# EAGLE design Optical Encoder 10-12-16 (EAGLE 7.2.0)
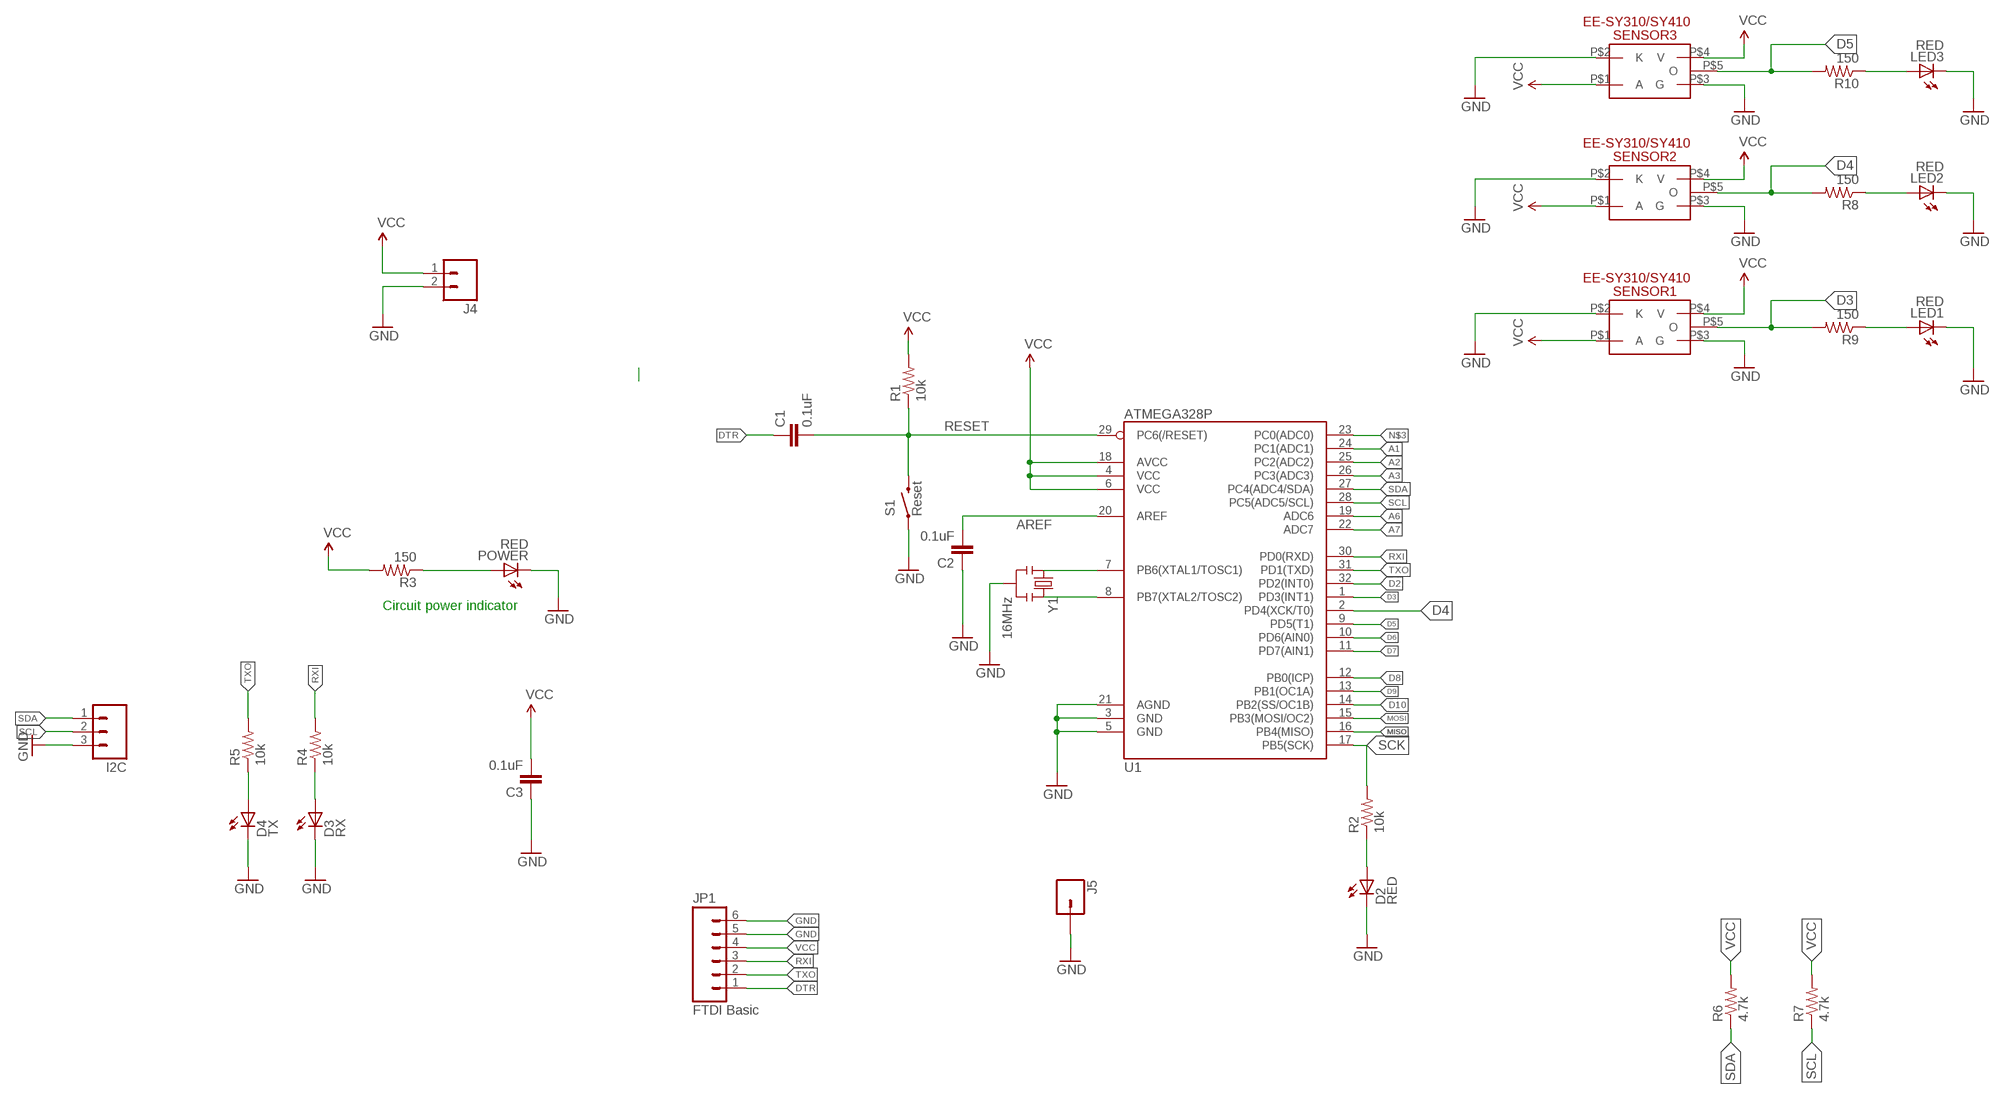
[diagram p0: schematic, sheet 1]

## Parts
C1  0.1uF  CAP0603-CAP  [0603-CAP]
C2  0.1uF  CAP0603-CAP  [0603-CAP]
C3  0.1uF  CAP0603-CAP  [0603-CAP]
D2  RED  LED-RED0603  [LED-0603]
D3  RX  LED-GREEN0603  [LED-0603]
D4  TX  LED-RED0603  [LED-0603]
I2C  M03PTH  [1X03]
J4  M02PTH  [1X02]
J5  M01PTH  [1X01]
JP1  FTDI Basic  M06POLAR  [MOLEX-1X6]
LED1  RED  LED-RED0603  [LED-0603]
LED2  RED  LED-RED0603  [LED-0603]
LED3  RED  LED-RED0603  [LED-0603]
POWER  RED  LED-RED0603  [LED-0603]
R1  10k  RESISTOR0603-RES  [0603-RES]
R2  10k  RESISTOR0603-RES  [0603-RES]
R3  150  RESISTOR1206  [1206]
R4  10k  RESISTOR0603-RES  [0603-RES]
R5  10k  RESISTOR0603-RES  [0603-RES]
R6  4.7k  RESISTOR1206  [1206]
R7  4.7k  RESISTOR1206  [1206]
R8  150  RESISTOR1206  [1206]
R9  150  RESISTOR1206  [1206]
R10  150  RESISTOR1206  [1206]
S1  Reset  SWITCH-MOMENTARY-2SMD  [TACTILE_SWITCH_SMD]
SENSOR1  EE-SY310/SY410  [EE-SY310/SY410]
SENSOR2  EE-SY310/SY410  [EE-SY310/SY410]
SENSOR3  EE-SY310/SY410  [EE-SY310/SY410]
U1  ATMEGA328P  ATMEGA328_SMT  [TQFP32-08]
Y1  16MHz  RESONATOR16MHZ  [RESONATOR-SMD]

## Nets
A1: U1.24(PC1(ADC1))
A2: U1.25(PC2(ADC2))
A3: U1.26(PC3(ADC3))
A6: U1.19(ADC6)
A7: U1.22(ADC7)
AREF: C2.2 U1.20(AREF)
D2: U1.32(PD2(INT0))
D3: R9.2 SENSOR1.P$5(O) U1.1(PD3(INT1))
D4: R8.2 SENSOR2.P$5(O) U1.2(PD4(XCK/T0))
D5: R10.2 SENSOR3.P$5(O) U1.9(PD5(T1))
D6: U1.10(PD6(AIN0))
D7: U1.11(PD7(AIN1))
D8: U1.12(PB0(ICP))
D9: U1.13(PB1(OC1A))
D10: U1.14(PB2(SS/OC1B))
DTR: C1.1 JP1.1
GND: C2.1 C3.1 D2.C D3.C D4.C I2C.3 J4.2 J5.1 JP1.5 JP1.6 LED1.C LED2.C LED3.C POWER.C S1.1 SENSOR1.P$2(K) SENSOR1.P$3(G) SENSOR2.P$2(K) SENSOR2.P$3(G) SENSOR3.P$2(K) SENSOR3.P$3(G) U1.3(GND) U1.5(GND) U1.21(AGND) Y1.2
MISO: U1.16(PB4(MISO))
MOSI: U1.15(PB3(MOSI/OC2))
N$1: U1.7(PB6(XTAL1/TOSC1)) Y1.1
N$2: U1.8(PB7(XTAL2/TOSC2)) Y1.3
N$3: U1.23(PC0(ADC0))
N$4: D2.A R2.1
N$5: D3.A R4.1
N$6: D4.A R5.1
N$7: LED1.A R9.1
N$9: POWER.A R3.1
N$19: LED3.A R10.1
N$20: LED2.A R8.1
RESET: C1.2 R1.1 S1.3 U1.29(PC6(/RESET))
RXI: JP1.3 R4.2 U1.30(PD0(RXD))
SCK: R2.2 U1.17(PB5(SCK))
SCL: I2C.2 R7.1 U1.28(PC5(ADC5/SCL))
SDA: I2C.1 R6.1 U1.27(PC4(ADC4/SDA))
TXO: JP1.2 R5.2 U1.31(PD1(TXD))
VCC: C3.2 J4.1 JP1.4 R1.2 R3.2 R6.2 R7.2 SENSOR1.P$1(A) SENSOR1.P$4(V) SENSOR2.P$1(A) SENSOR2.P$4(V) SENSOR3.P$1(A) SENSOR3.P$4(V) U1.4(VCC) U1.6(VCC) U1.18(AVCC)

## Notes on the sheet
- Circuit power indicator

## Library data of the parts
C1-C3 = SparkFun-Passives:CAP: Capacitor Standard 0603 ceramic capacitor, and 0.1" leaded capacitor.
D2 LED1-LED3 POWER = SparkFun-LED:LED-RED: Assorted Red LEDs LilyPad 1206- DIO-09912 1206- DIO-00809 0603- DIO-00819; PROD_ID: DIO-00819
D3 = SparkFun-LED:LED-GREEN: Various green LEDs Green LEDs used in SFE Production 0603- DIO-00821 LARGE- DIO-00862 LILYPAD- DIO-09910; PROD_ID: DIO-00821; VALUE: GREEN
D4 = SparkFun-LED:LED-RED: Assorted Red LEDs LilyPad 1206- DIO-09912 1206- DIO-00809 0603- DIO-00819; PROD_ID: DIO-00819; VALUE: RED
I2C = SparkFun-Connectors:M03: Header 3 Standard 3-pin 0.1" header. Use with straight break away headers (SKU : PRT-00116), right angle break away headers (PRT-00553), swiss pins (PRT-00743), machine pins (PRT-00117), and female headers (PRT-00115). Molex polarized connector foot print use with SKU : PRT-08232 with associated crimp pins and housings.
J4 = SparkFun-Connectors:M02: Standard 2-pin 0.1" header. Use with - straight break away headers ( PRT-00116) - right angle break away headers (PRT-00553) - swiss pins (PRT-00743) - machine pins (PRT-00117) - female headers (PRT-00115) Molex polarized connector foot print use with: PRT-08233 with associated crimp pins and housings. 2.54_SCREWTERM for use with PRT-10571. 3.5mm Screw Terminal footprints for PRT-08084 5mm Screw Terminal footprints for use with PRT-08432
J5 = SparkFun-Connectors:M01: Header 1 Standard 1-pin 0.1" header. Use with straight break away headers (SKU : PRT-00116), right angle break away headers (PRT-00553), swiss pins (PRT-00743), machine pins (PRT-00117), and female headers (PRT-00115). SMTSO-256-ET is a "flush mount" nut for a 4-40 screw. The older package used to be too tight, and did not allow it to sit properly thru the drill hit. The latest (0.165DIA) fits nice and snug.
JP1 = SparkFun-Connectors:M06: Header 6 Standard 6-pin 0.1" header. Use with straight break away headers (SKU : PRT-00116), right angle break away headers (PRT-00553), swiss pins (PRT-00743), machine pins (PRT-00117), and female headers (PRT-00115). Molex polarized connector foot print use with SKU : PRT-08094 with associated crimp pins and housings. NOTES ON THE VARIANTS LOCK and LOCK_LONGPADS... This footprint was designed to help hold the alignment of a through-hole component (i.e. 6-pin header) while soldering it into place. You may notice that each hole has been shifted either up or down by 0.005 of an inch from it's more standard position (which is a perfectly straight line). This slight alteration caused the pins (the squares in the middle) to touch the edges of the holes. Because they are alternating, it causes a "brace" to hold the component in place. 0.005 has proven to be the perfect amount of "off-center" position when using our standard breakaway headers. Although looks a little odd when you look at the bare footprint, once you have a header in there, the alteration is very hard to notice. Also,if you push a header all the way into place, it is covered up entirely on the bottom side. This idea of altering the position of holes to aid alignment will be further integrated into the Sparkfun Library for other footprints. It can help hold any component with 3 or more connection pins.
R1 R2 R4 R5 = SparkFun-Passives:RESISTOR: Resistor Basic schematic elements and footprints for 0603, 1206, and PTH resistors.
R3 R6-R10 = SparkFun-Resistors:RESISTOR: Resistor Basic schematic elements and footprints for 0603, 1206, and PTH resistors.
S1 = SparkFun-Electromechanical:SWITCH-MOMENTARY-2: Various NO switches- pushbuttons, reed, etc; PROD_ID: SWCH-08247
SENSOR1-SENSOR3 = EE-SY310-SY410:EE-SY310/SY410
U1 = SparkFun-DigitalIC:ATMEGA328_SMT: 32-Pin Atmega328 part Commonly used on Arduino compatible boards Available in QFP and QFN packages TQFP is IC-09069 QFN is non-stock; PROD_ID: IC-09069
Y1 = SparkFun-FreqCtrl:RESONATOR: Resonator Small SMD resonator. Used, eg, on the Arduino Pro/ Pro Mini boards. 8MHz- XTAL-08895 16MHz- XTAL-08900; PROD_ID: XTAL-08900

## Board
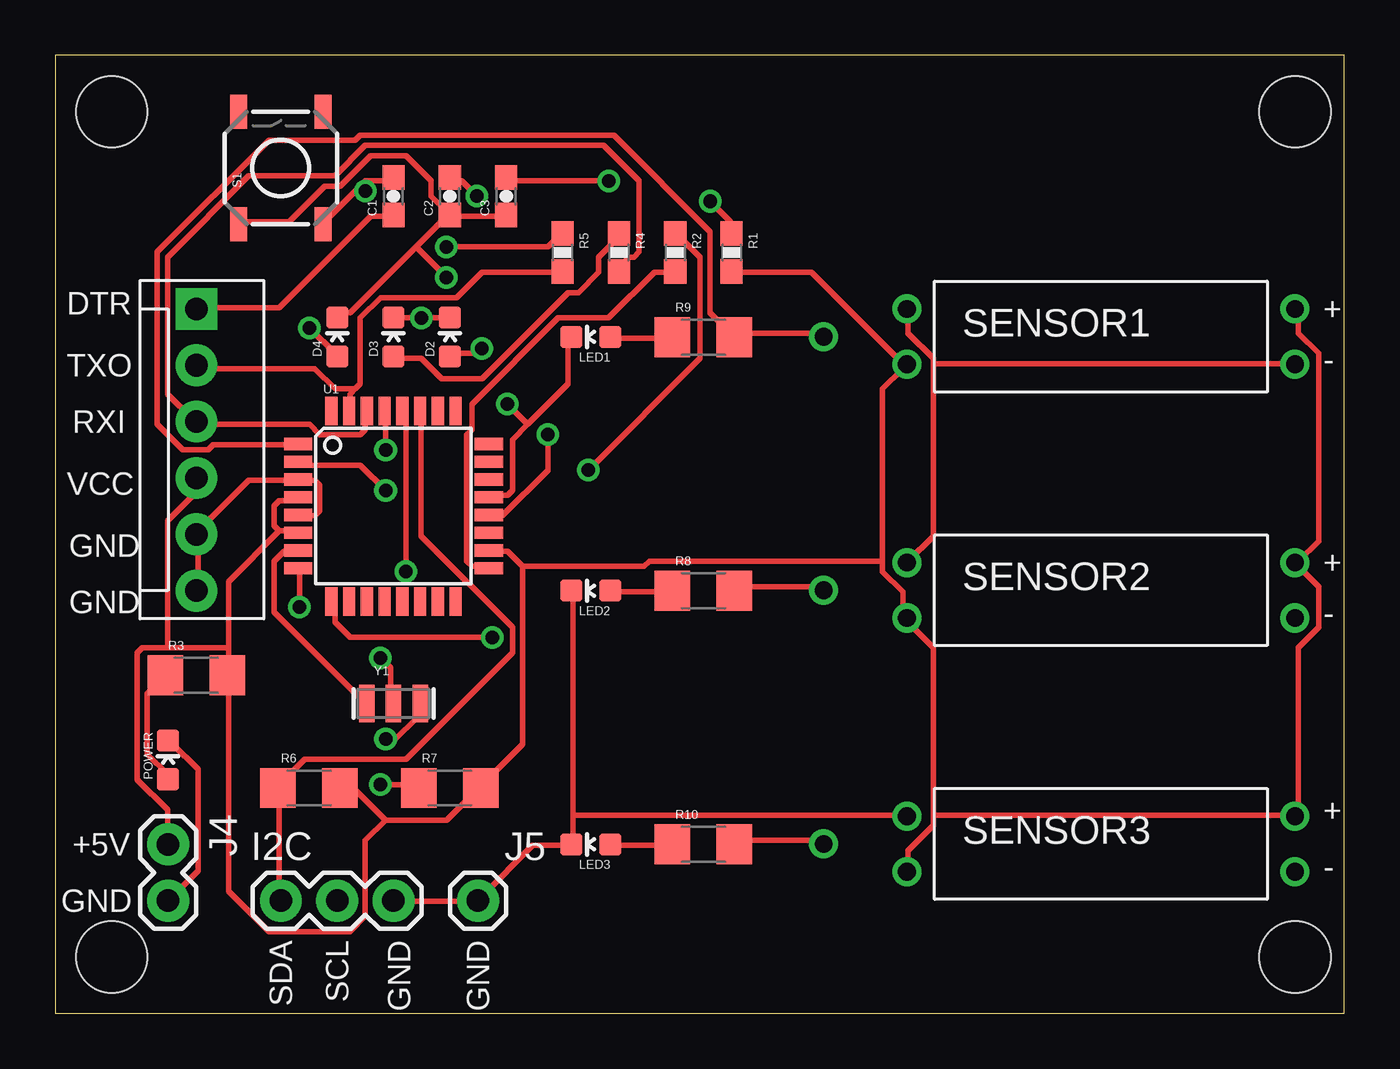
[diagram p1: board, top side]
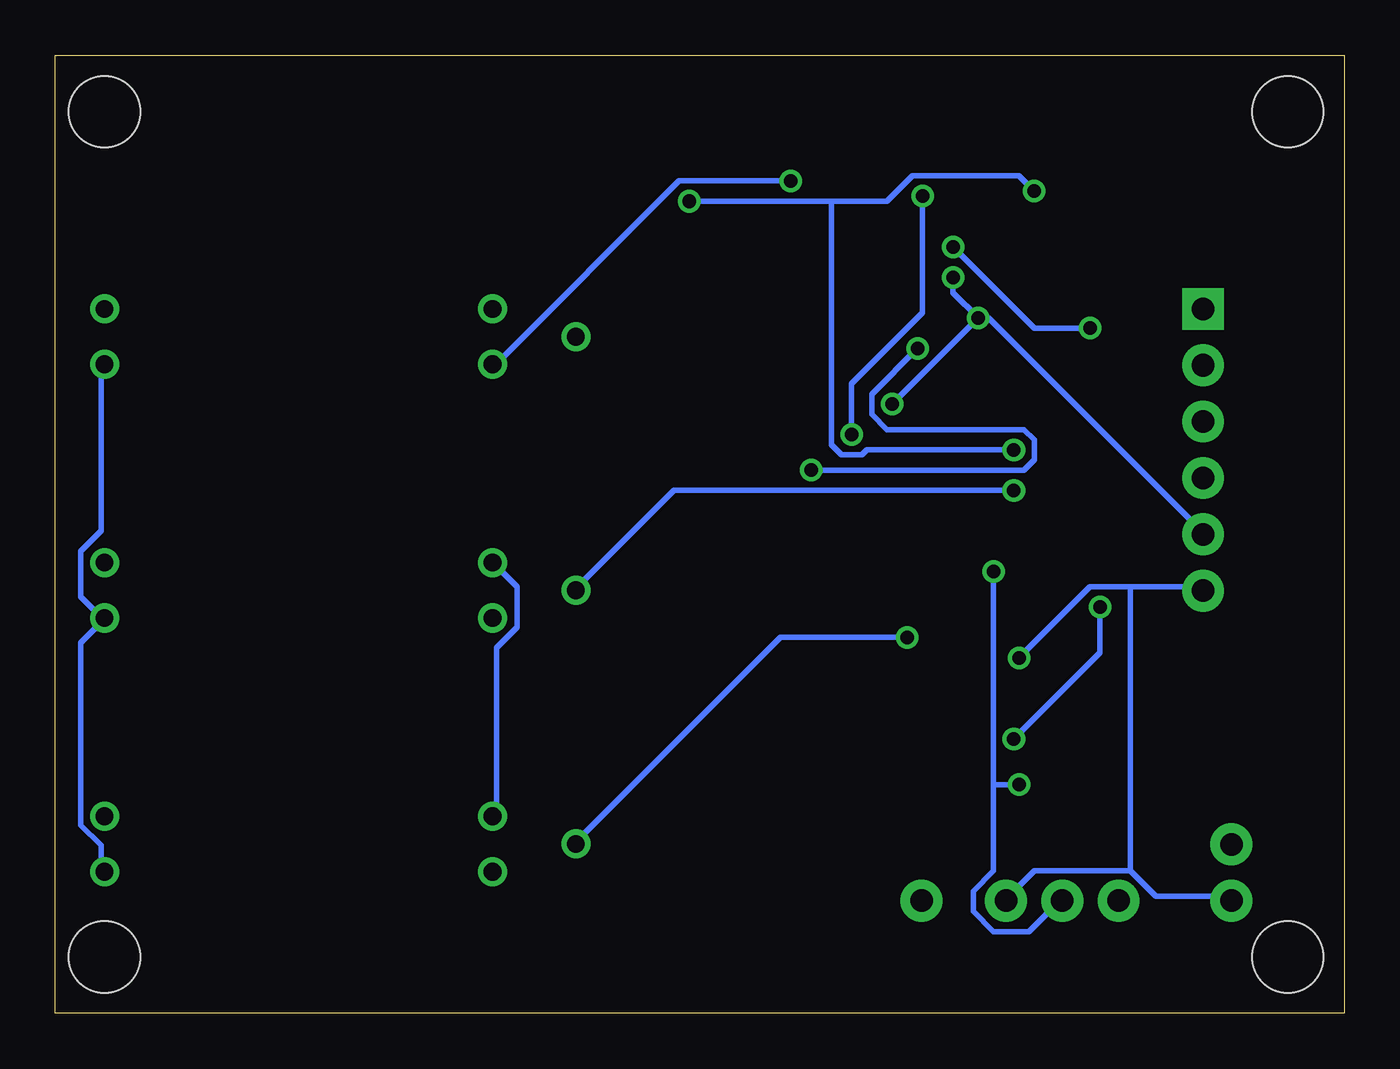
[diagram p2: board, bottom side, seen from below]

Size 58.09 x 43.17 mm. Coordinates in mm from the lower left corner, seen from the top.
Outline: 0,0 58.09,0 58.09,43.17 0,43.17 0,0
Copper layers (1*16): Top 0.035mm / dielectric 1.5mm / Bottom 0.035mm
Design rules "default": minimum track width 10mil, minimum drill 24mil, track to track 8mil, track to pad 8mil, pad to pad 8mil, via to via 8mil, smd to smd 8mil, copper to edge 40mil, drill to drill 8mil, minimum pad ring 10mil, minimum via ring 8mil, stop-mask expansion 4mil, vias tented up to drill 0mil, thermal gap 10mil
Holes 3.2 mm at 2.54,40.64 55.88,40.64 2.54,2.54 55.88,2.54

### Footprints (pad centres in the part's own frame; a part is rotated, then mirrored left to right if it is on the bottom)
0603-CAP = smd 1.1 x 1: 1 -0.85,0; 2 0.85,0
LED-0603 = smd 1 x 1: A 0,-0.877; C 0,0.877
1X03 = drill 1.016 pad 1.88: 1 0,0; 2 2.54,0; 3 5.08,0
1X02 = drill 1.016 pad 1.88: 1 0,0; 2 2.54,0
1X01 = drill 1.016 pad 1.88: 1 0,0
MOLEX-1X6 = drill 1.016 pad 1.88 square: 1 0,0 | drill 1.016 pad 1.88: 2 2.54,0; 3 5.08,0; 4 7.62,0; 5 10.16,0; 6 12.7,0
0603-RES = smd 1.1 x 1: 1 -0.85,0; 2 0.85,0
1206 = smd 1.6 x 1.8: 1 -1.4,0; 2 1.4,0
TACTILE_SWITCH_SMD = smd 1.524 x 0.762: 1 -2.54,1.905; 2 2.54,1.905; 3 -2.54,-1.905; 4 2.54,-1.905
EE-SY310/SY410 = drill 0.8: P$1 0,0; P$2 0,-2.5; P$3 -17.5,0; P$4 -17.5,-2.5; P$5 -21.25,-1.25
TQFP32-08 = smd 1.27 x 0.559: 1 -4.293,2.8; 2 -4.293,2; 3 -4.293,1.2; 4 -4.293,0.4; 5 -4.293,-0.4; 6 -4.293,-1.2; 7 -4.293,-2; 8 -4.293,-2.8; 17 4.293,-2.8; 18 4.293,-2; 19 4.293,-1.2; 20 4.293,-0.4; 21 4.293,0.4; 22 4.293,1.2; 23 4.293,2; 24 4.293,2.8 | smd 0.559 x 1.27: 9 -2.8,-4.293; 10 -2,-4.293; 11 -1.2,-4.293; 12 -0.4,-4.293; 13 0.4,-4.293; 14 1.2,-4.293; 15 2,-4.293; 16 2.8,-4.293; 25 2.8,4.293; 26 2,4.293; 27 1.2,4.293; 28 0.4,4.293; 29 -0.4,4.293; 30 -1.2,4.293; 31 -2,4.293; 32 -2.8,4.293
RESONATOR-SMD = smd 0.7 x 1.7: 1 -1.2,0; 2 0,0; 3 1.2,0

### Placement (x,y rotation side)
C1  15.24,36.83 90 top
C2  17.78,36.83 90 top
C3  20.32,36.83 90 top
D2  17.78,30.48 0 top
D3  15.24,30.48 0 top
D4  12.7,30.48 0 top
I2C  10.16,5.08 0 top
J4  5.08,7.62 270 top
J5  19.05,5.08 0 top
JP1  6.35,31.75 270 top
LED1  24.13,30.48 90 top
LED2  24.13,19.05 90 top
LED3  24.13,7.62 90 top
POWER  5.08,11.43 0 top
R1  30.48,34.29 270 top
R2  27.94,34.29 270 top
R3  6.35,15.24 0 top
R4  25.4,34.29 270 top
R5  22.86,34.29 270 top
R6  11.43,10.16 0 top
R7  17.78,10.16 0 top
R8  29.21,19.05 0 top
R9  29.21,30.48 0 top
R10  29.21,7.62 0 top
S1  10.16,38.1 90 top
SENSOR1  55.88,31.75 0 top
SENSOR2  55.88,20.32 0 top
SENSOR3  55.88,8.89 0 top
U1  15.24,22.86 0 top
Y1  15.24,13.97 0 top

### Tracks (layer width: path | path; a pad name or v marks a point on that pad's centre or on a via)
AREF  (via drill 0.61)
  Top 0.254: v19,36.83 18.31,37.52 17.86,37.52 C2.2 | v22.2,26.09 22.2,24.49 20.14,22.43 19.68,22.43 U1.20
  Bottom 0.254: v19,36.83 19,31.57 22.2,28.37 v22.2,26.09
D3
  Top 0.254: U1.1 10.77,25.63 7.11,25.63 6.88,25.4 5.74,25.4 4.6,26.54 4.6,34.31 9.63,39.34 13.51,39.34 13.74,39.57 25.17,39.57 29.52,35.23 29.52,31.57 30.43,30.66 R9.2 30.66,30.66 34.54,30.66 SENSOR1.P$5
D4  (via drill 0.61)
  Top 0.254: v14.88,23.57 13.74,24.71 11,24.71 U1.2 | R8.2 30.66,19.23 34.54,19.23 SENSOR2.P$5
  Bottom 0.254: v14.88,23.57 30.2,23.57 34.54,19.23 SENSOR2.P$5
D5  (via drill 0.61)
  Top 0.254: v19.68,16.94 13.28,16.94 12.6,17.63 12.6,18.54 U1.9 | R10.2 30.66,7.8 34.54,7.8 SENSOR3.P$5
  Bottom 0.254: v19.68,16.94 25.4,16.94 34.54,7.8 SENSOR3.P$5
DTR
  Top 0.254: C1.1 15.11,35.92 14.2,35.92 10.08,31.8 6.43,31.8 JP1.1
GND  (via drill 0.61)
  Top 0.254: 16.26,34.54 17.63,35.92 C2.1 | 16.26,34.54 13.28,31.57 12.83,31.57 D4.C | C3.1 20.14,35.92 17.86,35.92 C2.1 | S1.1 8.25,35.69 10.54,35.69 12.14,37.29 12.83,37.29 14.2,38.66 15.8,38.66 16.94,37.52 16.94,36.83 17.63,36.14 C2.1 | v14.66,16.03 15.11,15.57 15.11,13.97 Y1.2 | 21.29,26.54 20.6,25.86 20.6,23.57 20.37,23.34 19.68,23.34 U1.21 | 21.29,26.54 23.11,28.37 23.11,30.43 LED1.C | U1.5 11,22.43 11.68,22.43 11.91,22.66 11.91,23.8 11.68,24.03 11,24.03 U1.3 10.77,24.03 8.71,24.03 6.43,21.74 JP1.5 6.43,21.51 6.43,19.23 JP1.6 | D3.C 15.34,31.34 v16.48,31.34 17.63,31.34 D2.C | v20.37,27.46 21.29,26.54 | v17.63,33.17 16.26,34.54 | 39.57,29.29 39.57,21.51 38.43,20.37 SENSOR2.P$3 | 39.57,29.29 39.57,29.52 38.43,30.66 38.43,31.57 SENSOR1.P$3 | J4.2 6.43,6.43 6.43,11 5.28,12.14 POWER.C | 23.34,8.94 23.34,7.8 LED3.C 23.11,7.57 21.51,7.57 19.23,5.28 J5.1 19,5.05 15.34,5.05 I2C.3 | 23.34,8.94 23.34,19 LED2.C | 23.34,8.94 38.2,8.94 SENSOR3.P$3 | 39.57,29.29 55.8,29.29 SENSOR1.P$2
  Bottom 0.254: v14.66,16.03 11.45,19.23 9.63,19.23 | 9.63,19.23 6.43,19.23 JP1.6 | v16.48,31.34 16.03,31.34 6.43,21.74 JP1.5 | v16.48,31.34 v20.37,27.46 | v17.63,33.17 17.63,32.49 v16.48,31.34 | SENSOR3.P$2 56.03,6.43 56.03,7.57 56.95,8.48 56.95,16.71 56.03,17.63 SENSOR2.P$2 56.03,17.86 56.95,18.77 56.95,20.83 56.03,21.74 56.03,29.06 SENSOR1.P$2 | SENSOR3.P$3 38.2,8.94 38.2,16.48 37.29,17.4 37.29,19.23 38.2,20.14 SENSOR2.P$3 | 9.63,6.43 8.48,5.28 5.28,5.28 J4.2 | 9.63,6.43 13.97,6.43 15.11,5.28 I2C.3 | 9.63,6.43 9.63,19.23
N$1
  Top 0.254: U1.7 10.77,20.83 10.31,20.83 9.86,20.37 9.86,18.09 13.97,13.97 Y1.1
N$2  (via drill 0.61)
  Top 0.254: v11,18.31 11,19.91 U1.8 | v14.88,12.37 15.34,12.37 16.26,13.28 16.26,13.97 Y1.3
  Bottom 0.254: v11,18.31 11,16.26 v14.88,12.37
N$4  (via drill 0.61)
  Top 0.254: v19.23,29.97 19,29.74 17.86,29.74 D2.A | v24.03,24.49 29.06,29.52 29.06,34.09 28.14,35 R2.1
  Bottom 0.254: v19.23,29.97 21.29,27.91 21.29,27 20.6,26.31 14.43,26.31 13.97,25.86 13.97,24.94 14.43,24.49 v24.03,24.49
N$5
  Top 0.254: D3.A 15.34,29.52 16.48,29.52 17.4,28.6 19.23,28.6 23.11,32.49 23.57,32.49 24.49,33.4 24.49,34.09 25.4,35 R4.1
N$6  (via drill 0.61)
  Top 0.254: v11.45,30.89 12.6,29.74 D4.A | v17.63,34.54 22.2,34.54 22.66,35 R5.1
  Bottom 0.254: v11.45,30.89 13.97,30.89 v17.63,34.54
N$7
  Top 0.254: LED1.A 25.17,30.43 27.69,30.43 R9.1
N$9
  Top 0.254: POWER.A 5.05,10.77 4.14,11.68 4.14,14.43 4.83,15.11 R3.1
N$19
  Top 0.254: LED3.A 25.17,7.57 27.69,7.57 R10.1
N$20
  Top 0.254: LED2.A 25.17,19 27.69,19 R8.1
RESET  (via drill 0.61)
  Top 0.254: 13.74,37.29 12.14,35.69 S1.3 | 13.74,37.29 13.97,37.52 15.11,37.52 C1.2 | v29.52,36.6 30.43,35.69 30.43,35.23 R1.1 | 13.74,37.29 v13.97,37.06 | v14.88,25.4 14.88,27 U1.29
  Bottom 0.254: 23.11,36.6 20.6,36.6 19.46,37.74 14.66,37.74 v13.97,37.06 | 23.11,36.6 v29.52,36.6 | v14.88,25.4 21.51,25.4 21.74,25.17 22.66,25.17 23.11,25.63 23.11,36.6
RXI
  Top 0.254: R4.2 25.4,33.63 25.86,34.09 26.09,34.09 26.31,34.31 26.31,37.52 24.71,39.12 13.97,39.12 12.6,37.74 8.71,37.74 5.05,34.09 5.05,27.91 6.2,26.77 JP1.3 6.43,26.54 11.45,26.54 11.91,26.09 13.74,26.09 13.97,26.31 13.97,27 U1.30
SCK
  Top 0.254: R2.2 27.91,33.4 27,33.4 24.94,31.34 22.66,31.34 18.77,27.46 18.77,26.31 18.54,26.09 18.54,20.37 18.77,20.14 19.46,20.14 U1.17
SCL  (via drill 0.61)
  Top 0.254: v15.8,19.91 15.8,27 U1.28 | v14.66,10.31 16.26,10.31 R7.1
  Bottom 0.254: 15.8,10.31 15.8,6.43 16.71,5.51 16.71,4.6 15.8,3.68 14.2,3.68 12.83,5.05 I2C.2 | 15.8,10.31 v15.8,19.91 | 15.8,10.31 v14.66,10.31
SDA
  Top 0.254: U1.27 16.48,27 16.48,21.51 20.6,17.4 20.6,16.26 15.8,11.45 11.23,11.45 10.08,10.31 R6.1 10.08,10.08 10.08,5.28 I2C.1
TXO
  Top 0.254: 13.51,28.14 13.28,27.91 13.28,27.23 U1.31 | 13.51,28.14 13.74,28.37 13.74,31.34 14.66,32.26 18.09,32.26 19.23,33.4 22.66,33.4 R5.2 | 13.51,28.14 12.6,28.14 11.68,29.06 6.43,29.06 JP1.2
VCC  (via drill 0.61)
  Top 0.254: 10.08,21.74 10.77,21.74 U1.6 | 10.08,21.74 9.86,21.97 9.86,22.88 10.08,23.11 10.77,23.11 U1.4 | 7.8,16.48 7.8,19.46 10.08,21.74 | 7.8,16.48 7.8,15.34 R3.2 7.8,15.11 7.8,5.51 9.63,3.68 13.28,3.68 13.97,4.37 13.97,7.8 14.88,8.71 | 7.8,16.48 5.05,16.48 | 5.05,16.48 3.91,16.48 3.68,16.26 3.68,10.54 5.05,9.17 5.05,7.8 J4.1 | 5.05,16.48 5.05,22.2 6.2,23.34 6.2,24.03 JP1.4 | SENSOR1.P$1 56.03,31.57 56.03,30.66 56.95,29.74 56.95,21.29 56.03,20.37 SENSOR2.P$1 56.03,20.14 56.95,19.23 56.95,17.4 56.03,16.48 56.03,8.94 SENSOR3.P$1 55.8,8.94 39.57,8.94 | 21.06,20.14 20.37,20.83 19.68,20.83 U1.18 | 21.06,20.14 21.06,12.14 19.23,10.31 R7.2 19,10.08 17.63,8.71 14.88,8.71 | 14.88,8.71 13.51,10.08 13.06,10.08 R6.2 | 39.57,8.94 39.57,16.48 38.43,17.63 SENSOR2.P$4 38.2,17.86 38.2,19 37.29,19.91 37.29,20.37 | 39.57,8.94 39.57,8.48 38.43,7.34 38.43,6.43 SENSOR3.P$4 | v24.94,37.52 20.37,37.52 C3.2 | R1.2 30.66,33.4 34.09,33.4 38.2,29.29 SENSOR1.P$4 38.2,29.06 37.29,28.14 37.29,20.37 | 21.06,20.14 26.54,20.14 26.77,20.37 37.29,20.37
  Bottom 0.254: v24.94,37.52 29.97,37.52 38.2,29.29 SENSOR1.P$4

### Text on the board
_tsilk: DTR | + | TXO | - | RXI | VCC | GND | GND | + | - | + | +5V | - | GND | SDA | SCL | GND | GND